# EAGLE design spt_interface_v4_withbattcheck (EAGLE 7.5.0)
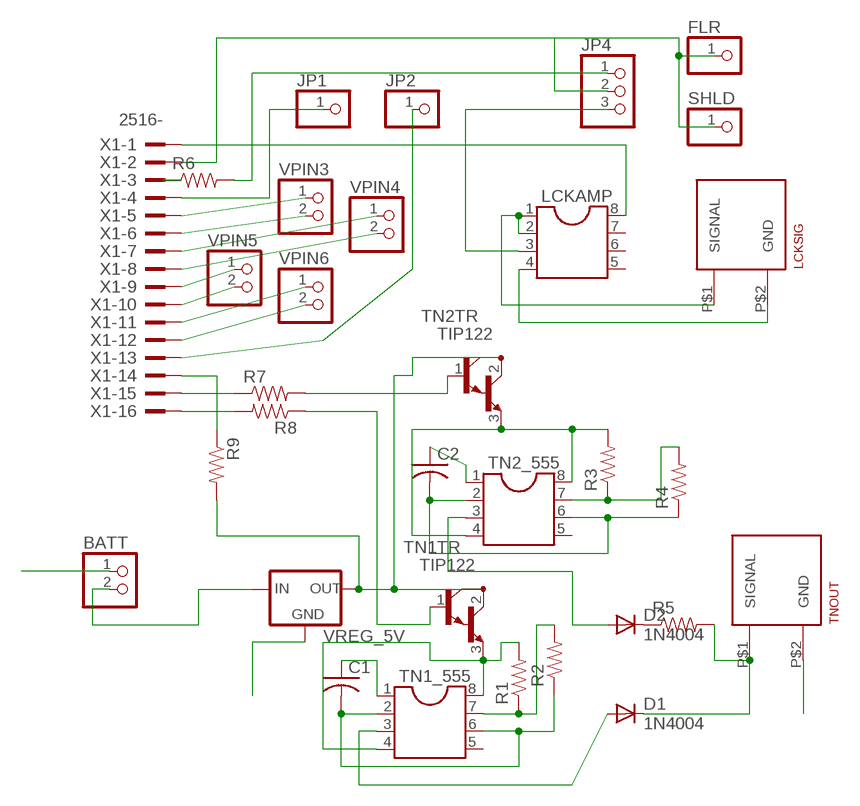
[diagram p0: schematic, sheet 1]

## Parts
BATT  PINHD-1X2  [1X02]
C1  C-US050-024X044  [C050-024X044]
C2  C-US050-024X044  [C050-024X044]
D1  1N4004  [DO41-10]
D2  1N4004  [DO41-10]
FLR  PINHD-1X1  [1X01]
JP1  PINHD-1X1  [1X01]
JP2  PINHD-1X1  [1X01]
JP4  PINHD-1X3  [1X03]
LCKAMP  DIL8  [DIL08]
LCKSIG  BNC_VERTICAL  [BNC_VERTICAL]
R1  RESISTORPTH-1/2W  [AXIAL-0.5]
R2  RESISTORPTH-1/2W  [AXIAL-0.5]
R3  RESISTORPTH-1/2W  [AXIAL-0.5]
R4  RESISTORPTH-1/2W  [AXIAL-0.5]
R5  RESISTORPTH-1/2W  [AXIAL-0.5]
R6  RESISTORPTH-1/2W  [AXIAL-0.5]
R7  RESISTORPTH-1/2W  [AXIAL-0.5]
R8  RESISTORPTH-1/2W  [AXIAL-0.5]
R9  RESISTORPTH-1/2W  [AXIAL-0.5]
SHLD  PINHD-1X1  [1X01]
TN1_555  DIL8  [DIL08]
TN1TR  TIP122  [TO220]
TN2_555  DIL8  [DIL08]
TN2TR  TIP122  [TO220]
TNOUT  BNC_VERTICAL  [BNC_VERTICAL]
VPIN3  PINHD-1X2  [1X02]
VPIN4  PINHD-1X2  [1X02]
VPIN5  PINHD-1X2  [1X02]
VPIN6  PINHD-1X2  [1X02]
VREG_5V  78XXL  [78XXL]
X1  2516-  [PAK100/2500-16]

## Nets
GND: BATT.1 C1.1 C2.1 FLR.1 JP4.2 LCKAMP.4 LCKSIG.P$2(GND) SHLD.1 TN1_555.1 TN2_555.1 TNOUT.P$2(GND) VREG_5V.GND X1.2
N$1: R9.P$1 X1.14
N$2: BATT.2 VREG_5V.IN
N$3: R7.P$2 TN2TR.1(B)
N$4: R8.P$1 TN1TR.1(B)
N$5: R1.P$2 TN1_555.4 TN1_555.8 TN1TR.3(E)
N$6: D2.C R5.P$1
N$7: R7.P$1 X1.15
N$8: LCKAMP.8 X1.1
N$9: D1.A TN1_555.3
N$10: LCKAMP.1 LCKAMP.2 LCKSIG.P$1(SIGNAL)
N$11: R3.P$1 R4.P$2 TN2_555.7
N$12: R1.P$1 R2.P$2 TN1_555.7
N$13: C2.2 R4.P$1 TN2_555.2 TN2_555.6
N$14: C1.2 R2.P$1 TN1_555.2 TN1_555.6
N$15: D2.A TN2_555.3
N$16: VPIN5.1 X1.9
N$17: D1.C R5.P$2 TNOUT.P$1(SIGNAL)
N$18: JP4.1 R6.P$2
N$19: R6.P$1 X1.3
N$20: VPIN3.1 X1.5
N$21: VPIN3.2 X1.6
N$22: VPIN4.1 X1.7
N$23: VPIN4.2 X1.8
N$24: VPIN5.2 X1.10
N$25: VPIN6.1 X1.11
N$26: VPIN6.2 X1.12
N$27: R3.P$2 TN2_555.4 TN2_555.8 TN2TR.3(E)
N$28: JP4.3 LCKAMP.3
N$30: JP1.1 X1.4
N$31: JP2.1 X1.13
N$34: R8.P$2 X1.16
N$35: R9.P$2 TN1TR.2(C) TN2TR.2(C) VREG_5V.OUT
Unconnected: LCKAMP.5 LCKAMP.6 LCKAMP.7 TN1_555.5 TN2_555.5

## Library data of the parts
BATT VPIN3-VPIN6 = pinhead:PINHD-1X2: PIN HEADER
C1 C2 = rcl:C-US: CAPACITOR, American symbol
D1 D2 = diode:1N4004: DIODE general purpose rectifier, 1 A
FLR JP1 JP2 SHLD = pinhead:PINHD-1X1: PIN HEADER
JP4 = pinhead:PINHD-1X3: PIN HEADER
LCKAMP TN1_555 TN2_555 = ic-package:DIL8: Dual In Line / Socket
LCKSIG TNOUT = open-ephys:BNC_VERTICAL: BNC plug, through-hole, vertical
R1-R9 = SparkFun-Resistors:RESISTOR: Resistor Basic schematic elements and footprints for 0603, 1206, and PTH resistors.
TN1TR TN2TR = transistor-npn:TIP122*: NPN Darlington Transistor
VREG_5V = v-reg:78XXL: VOLTAGE REGULATOR
X1 = con-3m:2516-: 3M (TM) Pak 100 4-Wall Header Source: 3M; OC_FARNELL: unknown; OC_NEWARK: unknown

## Board
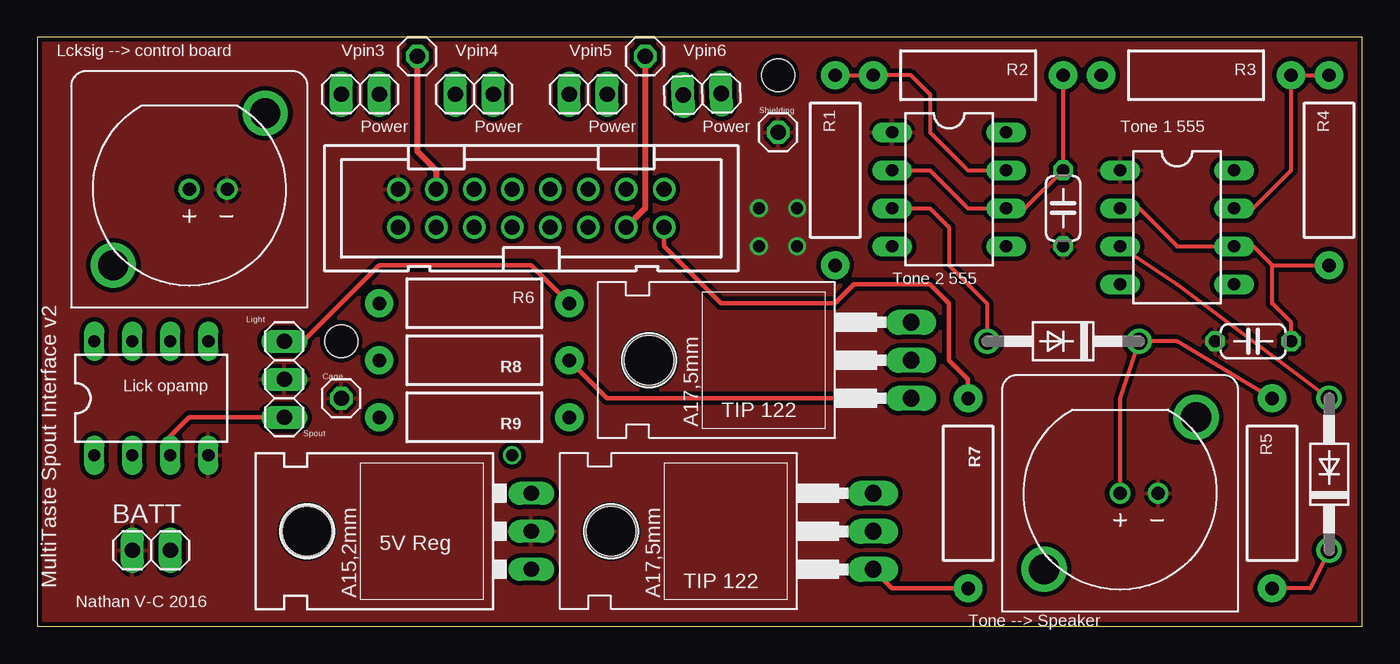
[diagram p1: board, top side]
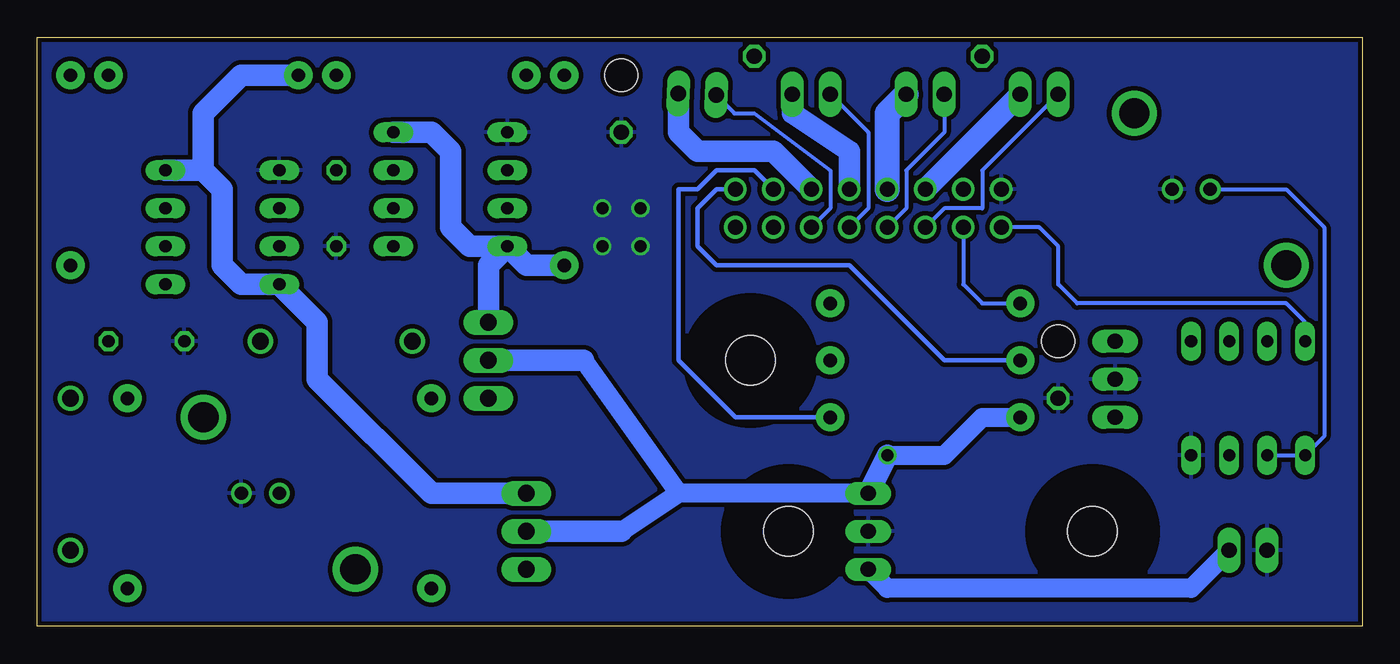
[diagram p2: board, bottom side, seen from below]

Size 88.57 x 39.36 mm. Coordinates in mm from the lower left corner, seen from the top.
Outline: 0,0 88.57,0 88.57,39.36 0,39.36 0,0
Copper layers (1*16): Top 0.035mm / dielectric 1.5mm / Bottom 0.035mm
Design rules "SeeedStudio_2layer_DRU_no_angle_20140221": minimum track width 6mil, minimum drill 12mil, track to track 6mil, track to pad 6mil, pad to pad 6mil, via to via 6mil, smd to smd 0mil, copper to edge 10mil, drill to drill 10mil, minimum pad ring 10mil, minimum via ring 6mil, stop-mask expansion 2mil, vias tented up to drill 100mil, thermal gap 10mil
Holes 2.2 mm at 20.32,19.05 49.53,36.83

### Footprints (pad centres in the part's own frame; a part is rotated, then mirrored left to right if it is on the bottom)
1X02 = drill 1.016 long: 1 -1.27,0; 2 1.27,0
C050-024X044 = drill 0.813 octagon: 1 -2.54,0; 2 2.54,0
DO41-10 = drill 1.118: A 5.08,0; C -5.08,0
1X01 = drill 1.016 octagon: 1 0,0
1X03 = drill 1.016 long: 1 -2.54,0; 2 0,0; 3 2.54,0
DIL08 = drill 0.813 long: 1 -3.81,-3.81; 2 -1.27,-3.81; 3 1.27,-3.81; 4 3.81,-3.81; 5 3.81,3.81; 6 1.27,3.81; 7 -1.27,3.81; 8 -3.81,3.81
BNC_VERTICAL = drill 0.89: P$1 0,0; P$2 2.54,0 | drill 2.01: P$3 5.08,5.08; P$4 -5.08,-5.08
AXIAL-0.5 = drill 0.9 pad 1.88: P$1 -6.35,0; P$2 6.35,0
TO220 = drill 1.118 long: 1 -2.54,-6.35; 2 0,-6.35; 3 2.54,-6.35 | hole 3.302: 0,11.176
78XXL = drill 1.016 long: GND 0,-3.81; IN -2.54,-3.81; OUT 2.54,-3.81 | hole 3.302: 0,11.176
PAK100/2500-16 = drill 1 pad 1.422: 1 -8.89,-1.27; 2 -8.89,1.27; 3 -6.35,-1.27; 4 -6.35,1.27; 5 -3.81,-1.27; 6 -3.81,1.27; 7 -1.27,-1.27; 8 -1.27,1.27; 9 1.27,-1.27; 10 1.27,1.27; 11 3.81,-1.27; 12 3.81,1.27; 13 6.35,-1.27; 14 6.35,1.27; 15 8.89,-1.27; 16 8.89,1.27

### Placement (x,y rotation side)
BATT  7.62,5.08 0 top
C1  68.58,27.94 90 top
C2  81.28,19.05 0 top
D1  68.58,19.05 180 top
D2  86.36,10.16 90 top
FLR  20.32,15.24 0 top
JP1  25.4,38.1 0 top
JP2  40.64,38.1 0 top
JP4  16.51,16.51 270 top
LCKAMP  7.62,15.24 0 top
LCKSIG  10.16,29.21 0 top
R1  53.34,30.48 270 top
R2  62.23,36.83 180 top
R3  77.47,36.83 180 top
R4  86.36,30.48 90 top
R5  82.55,8.89 90 top
R6  29.21,21.59 0 top
R7  62.23,8.89 270 top
R8  29.21,17.78 180 top
R9  29.21,13.97 180 top
SHLD  49.53,33.02 0 top
TN1_555  60.96,29.21 270 top
TN1TR  52.07,17.78 90 top
TN2_555  76.2,26.67 270 top
TN2TR  49.53,6.35 90 top
TNOUT  72.39,8.89 0 top
VPIN3  21.59,35.56 0 top
VPIN4  29.21,35.56 0 top
VPIN5  36.83,35.56 0 top
VPIN6  44.45,35.56 2.5 top
VREG_5V  29.21,6.35 90 top
X1  33.02,27.94 0 top

### Tracks (layer width: path | path; a pad name or v marks a point on that pad's centre or on a via)
GND  (via drill 0.8)
  other vias: 50.8,27.94 48.26,27.94 48.26,25.4 50.8,25.4
  pour Bottom (isolate 0.305): 0,0 0,39.37 88.9,39.37 88.9,0
  pour Top (isolate 0.305): 0,0 0,39.37 88.9,39.37 88.9,0
N$1
  Bottom 0.305: R9.P$1 41.91,13.97 45.72,17.78 45.72,29.21 44.45,29.21 43.18,30.48 40.64,30.48 X1.14
N$2
  Bottom 1.27: BATT.2 11.43,2.54 31.75,2.54 VREG_5V.IN
N$3
  Top 0.305: R7.P$2 57.15,2.54 TN2TR.1
N$4
  Top 0.305: R8.P$1 38.1,15.24 TN1TR.1
N$5
  Bottom 1.422: TN1TR.3 58.42,24.13 TN1_555.4 | TN1_555.4 55.88,24.13 R1.P$2 | TN1_555.4 59.69,25.4 60.96,26.67 60.96,31.75 62.23,33.02 TN1_555.8
N$6
  Top 0.254: D2.C 85.09,2.54 R5.P$1
N$7
  Top 0.305: R7.P$1 62.23,16.51 60.96,17.78 60.96,21.59 59.69,22.86 54.61,22.86 53.34,21.59 45.72,21.59 41.91,25.4 X1.15
N$8
  Bottom 0.254: LCKAMP.8 3.81,20.32 5.08,21.59 19.05,21.59 20.32,22.86 20.32,25.4 21.59,26.67 X1.1
N$9
  Top 0.254: TN1_555.3 59.69,27.94 60.96,26.67 60.96,24.13 63.5,21.59 D1.A
N$10
  Bottom 0.254: LCKSIG.P$1 5.08,29.21 2.54,26.67 2.54,12.7 LCKAMP.1 LCKAMP.2
N$11
  Top 0.254: TN2_555.7 81.28,27.94 83.82,30.48 R3.P$1 R4.P$2
N$12
  Top 0.254: TN1_555.7 62.23,30.48 59.69,33.02 59.69,35.56 58.42,36.83 R2.P$2 R1.P$1
N$13
  Top 0.254: TN2_555.2 73.66,27.94 76.2,25.4 TN2_555.6 81.28,25.4 82.55,24.13 | C2.2 83.82,20.32 82.55,21.59 82.55,24.13 | 82.55,24.13 R4.P$1
N$14
  Top 0.254: TN1_555.2 59.69,30.48 62.23,27.94 TN1_555.6 66.04,27.94 C1.2 R2.P$1
N$15
  Top 0.254: TN2_555.3 76.2,22.86 D2.A
N$16
  Bottom 0.254: VPIN5.1 33.02,33.02 33.02,27.94 X1.9
N$17
  Top 0.254: R5.P$2 76.2,19.05 D1.C 72.39,15.24 TNOUT.P$1
N$18
  Top 0.305: JP4.1 17.78,19.05 22.86,24.13 33.02,24.13 R6.P$2
N$19
  Bottom 0.254: X1.3 26.67,22.86 25.4,21.59 R6.P$1
N$20
  Bottom 0.254: VPIN3.1 25.4,30.48 25.4,27.94 27.94,27.94 X1.5
N$21
  Bottom 1.422: X1.6 VPIN3.2
N$22
  Bottom 0.254: VPIN4.1 27.94,33.02 30.48,30.48 30.48,27.94 X1.7
N$23
  Bottom 1.676: X1.8 31.75,34.29 VPIN4.2
N$24
  Bottom 1.422: X1.10 34.29,31.75 38.1,34.29 VPIN5.2
N$25
  Bottom 0.254: VPIN6.1 41.97,34.29 40.64,34.29 35.56,30.48 35.56,27.94 X1.11
N$26
  Bottom 1.422: X1.12 39.37,31.75 44.45,31.75 45.72,33.02 VPIN6.2
N$27
  Bottom 1.422: TN2TR.3 62.23,8.89 69.85,16.51 69.85,20.32 TN2_555.4 74.93,22.86 76.2,24.13 76.2,29.21 77.47,30.48 | 77.47,30.48 TN2_555.8 | R3.P$2 74.93,36.83 77.47,34.29 77.47,30.48
N$28
  Top 0.305: LCKAMP.3 8.89,12.7 10.16,13.97 JP4.3
N$30
  Top 0.406: JP1.1 25.4,31.75 26.67,30.48 X1.4
N$31
  Top 0.406: JP2.1 40.64,27.94 X1.13
N$34
  Bottom 0.305: R8.P$2 27.94,17.78 34.29,24.13 43.18,24.13 44.45,25.4 44.45,27.94 43.18,29.21 X1.16
N$35  (via drill 0.8)
  Bottom 1.27: VREG_5V.OUT 45.72,8.89 | 45.72,8.89 52.07,17.78 | 49.53,6.35 45.72,8.89 | v31.75,11.43 27.94,11.43 25.4,13.97 R9.P$2
  Bottom 1.422: TN2TR.2 49.53,6.35 | 52.07,17.78 TN1TR.2 | v31.75,11.43 VREG_5V.OUT

### Text on the board
tPlace: Lcksig --> control board | Vpin3 | Vpin4 | Vpin5 | Vpin6 | R2 | R3 | Shielding | Power | Power | Power | Power | R1 | Tone 1 555 | R4 | Tone 2 555 | R6 | Light | Lick opamp | Cage | TIP 122 | Spout | R5 | 5V Reg | MultiTaste Spout Interface v2 | TIP 122 | Nathan V-C 2016 | Tone --> Speaker